# Altium schematic sheet Sheet1.SchDoc
size 750 x 500 mm; SheetNumber: 1; SheetTotal: 1
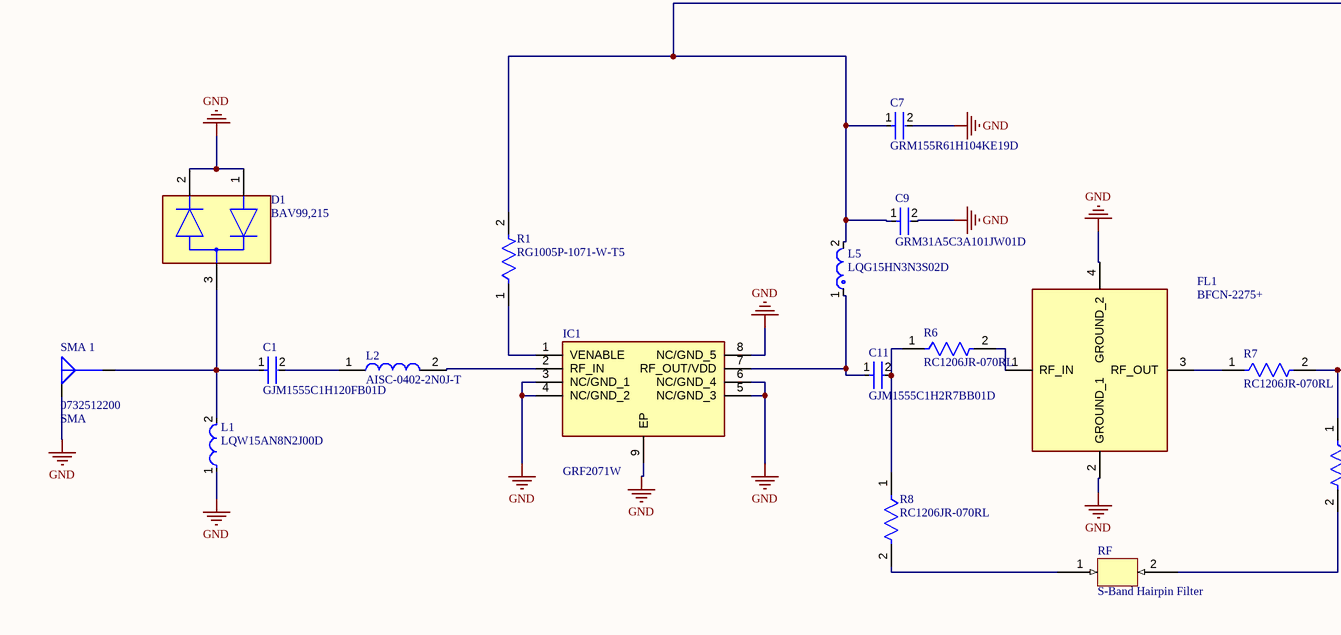
[diagram p0: Sheet1.SchDoc, left]
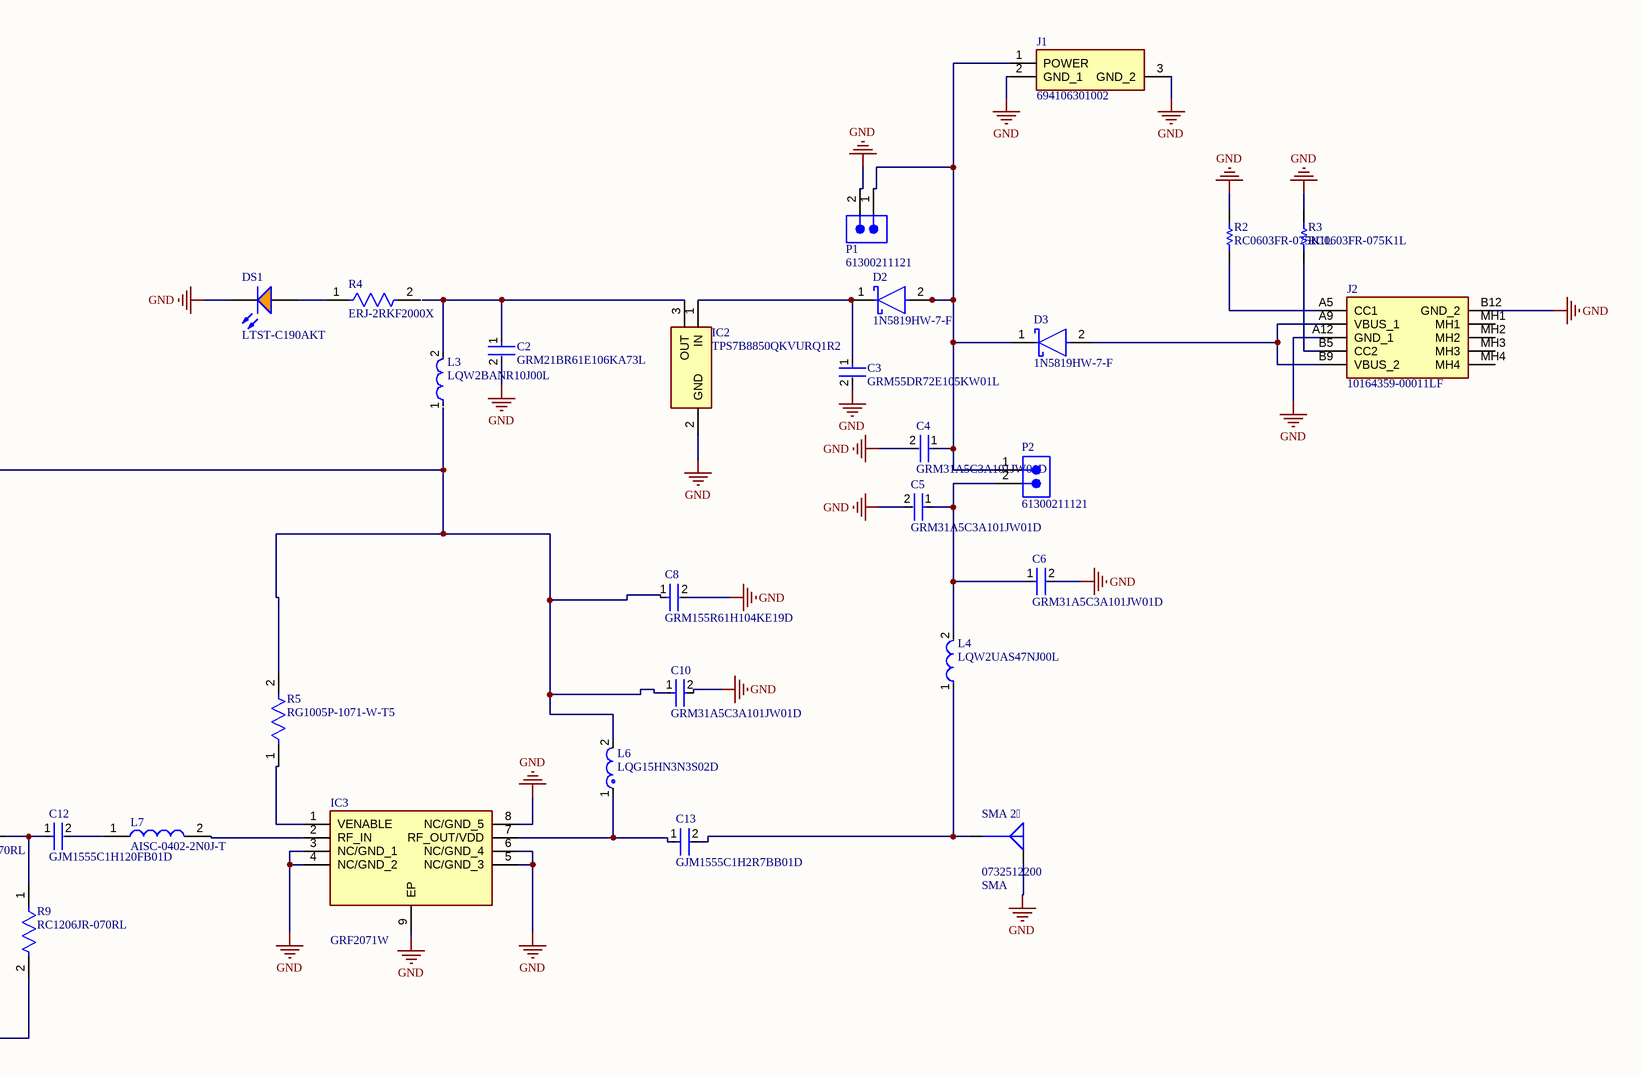
[diagram p1: Sheet1.SchDoc, right]

## Parts
C1  GJM1555C1H120FB01D  [FP-GJM155-0_05-IPC_A]
C2  GRM21BR61E106KA73L  [FP-GRM21B-0_15-IPC_C]
C3  GRM55DR72E105KW01L  [FP-GRM55D-0_4-IPC_A]
C4  GRM31A5C3A101JW01D  [FP-GRM31A-0_2-e0_3_0_95-IPC_B]
C5  GRM31A5C3A101JW01D  [FP-GRM31A-0_2-e0_3_0_95-IPC_B]
C6  GRM31A5C3A101JW01D  [FP-GRM31A-0_2-e0_3_0_95-IPC_B]
C7  GRM155R61H104KE19D  [FP-GRM155-0_05-IPC_A]
C8  GRM155R61H104KE19D  [FP-GRM155-0_05-IPC_A]
C9  GRM31A5C3A101JW01D  [FP-GRM31A-0_2-e0_3_0_95-IPC_B]
C10  GRM31A5C3A101JW01D  [FP-GRM31A-0_2-e0_3_0_95-IPC_B]
C11  GJM1555C1H2R7BB01D  [FP-GJM155-0_05-IPC_A]
C12  GJM1555C1H120FB01D  [FP-GJM155-0_05-IPC_A]
C13  GJM1555C1H2R7BB01D  [FP-GJM155-0_05-IPC_A]
D1  BAV99,215  [FP-SOT23-MFG]
D2  1N5819HW-7-F  [FP-SOD123-IPC_A]
D3  1N5819HW-7-F  [FP-SOD123-IPC_A]
DS1  LTST-C190AKT  [LTST-C190AKT-2_V]
FL1  BFCN-2275+  [BFCN2275]
IC1  GRF2071W  [SON50P200X200X75-9N]
IC2  TPS7B8850QKVURQ1R2  [TPS7B8850QKVURQ1R2]
IC3  GRF2071W  [SON50P200X200X75-9N]
J1  694106301002  [694106301002_1]
J2  10164359-00011LF  [1016435900011LF]
L1  LQW15AN8N2J00D  [FP-LQW15AN_00-W0_6-0_1-MFG]
L2  AISC-0402-2N0J-T  [AISC040210NGT]
L3  LQW2BANR10J00L  [FP-LQW2BAN_00-MFG]
L4  LQW2UAS47NJ00L  [FP-LQW2UAS_00-MFG]
L5  LQG15HN3N3S02D  [FP-LQG15HH_02-IPC_A]
L6  LQG15HN3N3S02D  [FP-LQG15HH_02-IPC_A]
L7  AISC-0402-2N0J-T  [AISC040210NGT]
P1  61300211121  [61300211121]
P2  61300211121  [61300211121]
R1  RG1005P-1071-W-T5  [FP-RG1005-IPC_C]
R2  RC0603FR-075K1L  [RESC1608X55X25ML10T15]
R3  RC0603FR-075K1L  [RESC1608X55X25ML10T15]
R4  ERJ-2RKF2000X  [FP-ERJ2RK-IPC_A]
R5  RG1005P-1071-W-T5  [FP-RG1005-IPC_C]
R6  RC1206JR-070RL  [FP-RC1206-MFG]
R7  RC1206JR-070RL  [FP-RC1206-MFG]
R8  RC1206JR-070RL  [FP-RC1206-MFG]
R9  RC1206JR-070RL  [FP-RC1206-MFG]
RF  S-Band Hairpin Filter  [S-BAND Hairpin Filter]
SMA_1  0732512200  Connector Style: SMA  [MOLEX SD-73251-220 (NICKEL, 2.79MM FEET)]
SMA_2  0732512200  Connector Style: SMA  [MOLEX SD-73251-220 (NICKEL, 2.79MM FEET)]

## Nets
GND: C2.2 C3.2 C4.2 C5.2 C6.2 C7.2 C8.2 C9.2 C10.2 D1.1 D1.2 DS1.2(K) FL1.2(GROUND_1) FL1.4(GROUND_2) IC1.3(NC/GND_1) IC1.4(NC/GND_2) IC1.5(NC/GND_3) IC1.6(NC/GND_4) IC1.8(NC/GND_5) IC1.9(EP) IC2.2(GND) IC3.3(NC/GND_1) IC3.4(NC/GND_2) IC3.5(NC/GND_3) IC3.6(NC/GND_4) IC3.8(NC/GND_5) IC3.9(EP) J1.2(GND_1) J1.3(GND_2) J2.A12(GND_1) J2.B12(GND_2) L1.1 P1.2 R2.2 R3.2 SMA_1.G SMA_2.G
NetC1_1: C1.1 D1.3 L1.2 SMA_1.S
NetC1_2: C1.2 L2.1
NetC2_1: C2.1 IC2.3(OUT) L3.2
NetC3_1: C3.1 D2.1(C) IC2.1(IN)
NetC4_1: C4.1 D2.2(A) D3.1(C) J1.1(POWER) P1.1 P2.1
NetC5_1: C5.1 C6.1 L4.2 P2.2
NetC7_1: C7.1 C8.1 C9.1 C10.1 L5.2 L6.2 R1.2 R5.2
NetC11_1: C11.1 IC1.7(RF_OUT/VDD) L5.1
NetC11_2: C11.2 R6.1 R8.1
NetC12_1: C12.1 R7.2 R9.1
NetC12_2: C12.2 L7.1
NetC13_1: C13.1 IC3.7(RF_OUT/VDD) L6.1
NetC13_2: C13.2 L4.1 SMA_2.S
NetD3_2: D3.2(A) J2.A9(VBUS_1) J2.B9(VBUS_2)
NetDS1_1: DS1.1(A) R4.1
NetFL1_1: FL1.1(RF_IN) R6.2
NetFL1_3: FL1.3(RF_OUT) R7.1
NetIC1_1: IC1.1(VENABLE) R1.1
NetIC1_2: IC1.2(RF_IN) L2.2
NetIC3_1: IC3.1(VENABLE) R5.1
NetIC3_2: IC3.2(RF_IN) L7.2
NetJ2_A5: J2.A5(CC1) R2.1
NetJ2_B5: J2.B5(CC2) R3.1
NetR8_2: R8.2 RF.1
NetR9_2: R9.2 RF.2

Not connected (* = marked no-connect by the designer): J2 MH1 MH2 MH3 MH4; L3 1; R4 2

## Notes on the sheet
- THIS DOCUMENT AND THE DATA DISCLOSED HEREIN OR
- HEREWITH IS THE PROPERTY OF ALTIUM LIMITED AND MAY
- DWG NO:
- REVISION
- REV:
- DESCRIPTION
- DATE
- APPROVED
- BE FREELY DISTRIBUTED IN WHOLE. NO RIGHTS ARE
- RESERVED OR EXPRESS OR IMPLIED WARANTEE GIVEN.
- ENG:
- APPROVALS
- PROJECT
- DSN:
- CHK:
- REFERENCE DOCUMENTS
- PROJECT REVISION:
- TITLE
- DOCUMENT REVISION:
- DESIGN ITEM:
- BOM:
- FAB DWG:
- PCB DWG:
- ASSY DWG:
- SCALE:
- A3
- SIZE
- CAGE CODE
- FILE NAME
- DWG NO.
- SHEET
- OF
- REV

## Library data of the parts
C1 C12 = CMP-06035-011502-1: Multi-Layer Ceramic Capacitor 12pF C0G  ±1% 0402 Paper T/R; Voltage Rating (DC): 50V; Dielectric: C0G; Case/Package: 0402; Termination: SMD/SMT; Case Code (Imperial): 0402; Case Code (Metric): 1005; Tolerance: 1%; Length: 1mm; Package Quantity: 10000; Voltage Rating: 50V; Depth: 0.5mm; Capacitance: 12pF; Packaging: Tape and Reel; Thickness: 0.022inch; Height: 0.5mm; Mount: Surface Mount; Radiation Hardening: No; Min Operating Temperature: -55°C; Max Operating Temperature: 125°C; Width: 0.02inch
C2 = CMP-2007-03541-2: Chip Multilayer Ceramic Capacitors for General Purpose, 0805, 10uF, X5R, 15%, 10%, 25V; Length: 2mm; Depth: 1.25mm; Termination: SMD/SMT; Voltage: 25V; Height: 1.25mm; Material: Ceramic; Thickness: 0.053inch; Radiation Hardening: No; Min Operating Temperature: -55°C; Width: 0.049inch; Package Quantity: 1; Mount: Surface Mount; Dielectric: X5R; Packaging: Tape and Reel; Capacitance: 10uF; Voltage Rating (DC): 25V; Lead Free: Lead Free; Max Operating Temperature: 85°C; Case Code (Imperial): 0805; Case/Package: 0805; Tolerance: 10%; Voltage Rating: 25V; Case Code (Metric): 2012
C3 = CMP-2000-06370-2: Chip Multilayer Ceramic Capacitors for General Purpose, 2220, 1.0uF, X7R, 15%, 10%, 250V; Capacitance: 1uF; Width: 5mm; Height: 2mm; Case Code (Imperial): 2220; Voltage Rating (DC): 250V; Max Operating Temperature: 125°C; Number of Pins: 2; Min Operating Temperature: -55°C; Termination: SMD/SMT; Case/Package: 2220; Dielectric: X7R; Material: Ceramic; REACH SVHC: No SVHC; Voltage: 250V; Packaging: Tape and Reel; Thickness: 0.087inch; Depth: 5mm; Package Quantity: 1; Tolerance: 10%; Mount: Surface Mount; Voltage Rating: 250V; Length: 5.7mm; Case Code (Metric): 5750; Lead Free: Lead Free
C4-C6 C9 C10 = CMP-06035-024306-1: Chip Multilayer Ceramic Capacitors for General Purpose, 1206, 100pF, C0G, 30ppm/°C, 5%, 1kV; Thickness: 0.039inch; Min Operating Temperature: -55°C; Voltage Rating: 1kV; Depth: 1.6mm; Temperature Coefficient: 30ppm/°C; Radiation Hardening: No; Case Code (Metric): 3216; Tolerance: 5%; Length: 3.2mm; Width: 0.063inch; Max Operating Temperature: 125°C; Voltage: 1kV; Capacitance: 100pF; Case Code (Imperial): 1206; Package Quantity: 4000; Dielectric: C0G; REACH SVHC: No SVHC; Voltage Rating (DC): 1kV; Case/Package: 1206; Mount: Surface Mount; Dielectric Material: Ceramic; Height: 1mm; Packaging: Tape and Reel; Termination: SMD/SMT
C7 C8 = CMP-2008-04108-2: Chip Multilayer Ceramic Capacitors for General Purpose, 0402, 0.10uF, X5R, 15%, 10%, 50V; Capacitance: 100nF; Case/Package: 0402; Voltage: 50V; Dielectric: X5R; Height: 0.5mm; Case Code (Metric): 1005; Length: 1mm; Width: 0.02inch; Mount: Surface Mount; Case Code (Imperial): 0402; Lead Free: Lead Free; Depth: 0.5mm; Max Operating Temperature: 85°C; Tolerance: 10%; Voltage Rating (DC): 50V; Packaging: Tape and Reel; REACH SVHC: No SVHC; Voltage Rating: 50V; Min Operating Temperature: -55°C; Thickness: 0.022inch
C11 C13 = CMP-2008-03840-2: Multi-Layer Ceramic Capacitor 2.7pF C0G  ±0.1pF 0402 Paper T/R; Voltage Rating (DC): 50V; Temperature Coefficient: 30ppm/°C; Max Operating Temperature: 125°C; Lead Free: Lead Free; REACH SVHC: No SVHC; Thickness: 0.022inch; Length: 1mm; Height: 0.5mm; Min Operating Temperature: -55°C; Mount: Surface Mount; Case/Package: 0402; Case Code (Imperial): 0402; Width: 0.02inch; Capacitance: 2.7pF; Packaging: Tape and Reel; Package Quantity: 10000; Lead Pitch: 0.3mm; Dielectric: C0G; Depth: 0.5mm; Voltage Rating: 50V; Radiation Hardening: No; Termination: SMD/SMT; Voltage: 50V; Number of Pins: 2; Case Code (Metric): 1005
D1 = CMP-14399-000006-1: DIODE ARRAY GP 100V 215MA SOT23
D2 D3 = CMP-0303-00003-3: DIODE SCHOTTKY 40V 1A SOD123; Forward Voltage: 450mV; Capacitance: 110pF; Max Forward Surge Current (Ifsm): 25A; Peak Reverse Current: 50uA; Polarity: Standard; Element Configuration: Single; Max Power Dissipation: 450mW; Min Operating Temperature: -65°C; Package Quantity: 3000; Contact Plating: Tin; Weight: 0.000353oz; Max Repetitive Reverse Voltage (Vrrm): 40V; Max Reverse Voltage (DC): 40V; Height: 1.25mm; Average Rectified Current: 1A; Width: 1.7mm; Case/Package: SOD-123-2; Lead Free: Lead Free; Max Operating Temperature: 125°C; Current Rating: 1A; Termination: SMD/SMT; Forward Current: 1A; Radiation Hardening: No; Number of Pins: 2; Length: 2.85mm; Voltage Rating (DC): 40V; REACH SVHC: No SVHC; Peak Non-Repetitive Surge Current: 25A; Packaging: Tape and Reel; Output Current: 1A
DS1 = CMP-007-00021-2: LED Uni-Color Orange, 100 mW, 30 mA, -55 to 85 degC, 2-Pin SMD, RoHS, Tape and Reel; Manufacturer: Lite-On; Lens Style: Clear; Forward Voltage: 2.1V; Luminous Intensity: 2mcd; Forward Current: 20mA; Viewing Angle: 130degrees; Package Reference: LTST-C190AKT-2; Case/Package: 0603; Min Operating Temperature: -55°C; Package Quantity: 3000; Illumination Colour: Orange; RoHS Compliant: True; Mounting Technology: SM; Manufacturer URL: http://www.us.liteon.com/; Datasheet URL: http://datasheet.octopart.com/LTST-C190AKT-Lite-On-datasheet-11729267.pdf; Pins: 2; Max Operating Temperature: 85°C; Packaging: TapeandReel; Colour: Orange; Nominal Vf: 2.1V; Datasheet Version: Jan-03; Package Description: 2-Pin Surface Mount Device, Body 1.6 x 0.8 mm
FL1 = BFCN-2275+: Filter; Manufacturer_Name: Mini-Circuits; Datasheet Link: https://www.minicircuits.com/pdfs/BFCN-2275+.pdf; Height: 0.94mm; Manufacturer_Part_Number: BFCN-2275+; Mouser Part Number: 139-BFCN-2275; Mouser Price/Stock: https://www.mouser.co.uk/ProductDetail/Mini-Circuits/BFCN-2275%2b?qs=xZ%2FP%252Ba9zWqbiN5sUHOguOg%3D%3D
IC1 IC3 = GRF2071W: Integrated Circuit; Manufacturer_Name: Guerrilla RF; Datasheet Link: https://www.mouser.com/datasheet/2/777/GRF2071_WDS-1891829.pdf; Height: 0.75mm; Manufacturer_Part_Number: GRF2071W; Mouser Part Number: 459-GRF2071W; Mouser Price/Stock: https://www.mouser.co.uk/ProductDetail/Guerrilla-RF/GRF2071W?qs=hWgE7mdIu5R0hLsGsKbNEA%3D%3D
IC2 = TPS7B8850QKVURQ1R2: Integrated Circuit; Manufacturer_Name: Texas Instruments; Datasheet Link: https://www.ti.com/lit/ds/symlink/tps7b88-q1.pdf?ts=1678685515389&ref_url=https%253A%252F%252Fwww.ti.com%252Fproduct%252FTPS7B88-Q1%252Fpart-details%252FTPS7B8850QKVURQ1R2; Height: 2.65mm; Manufacturer_Part_Number: TPS7B8850QKVURQ1R2; Mouser Part Number: 595-S7B8850QKVURQ1R2; Mouser Price/Stock: https://www.mouser.co.uk/ProductDetail/Texas-Instruments/TPS7B8850QKVURQ1R2?qs=e8oIoAS2J1TpaCt8B0rPIw%3D%3D; Arrow Part Number: TPS7B8850QKVURQ1R2; Arrow Price/Stock: https://www.arrow.com/en/products/tps7b8850qkvurq1r2/texas-instruments?region=nac
J1 = 694106301002: Connector; Manufacturer_Name: Wurth Elektronik; Datasheet Link: https://datasheet.datasheetarchive.com/originals/distributors/Datasheets_SAMA/1c153bd2ba42bb51bda59ee4cd9765cd.pdf; Manufacturer_Part_Number: 694106301002; Mouser Part Number: 710-694106301002; Mouser Price/Stock: https://www.mouser.co.uk/ProductDetail/Wurth-Elektronik/694106301002?qs=a9WhcLg8qCwOEkcI62k5mA%3D%3D
J2 = 10164359-00011LF: Connector; Manufacturer_Name: Amphenol; Datasheet Link: https://cdn.amphenol-cs.com/media/wysiwyg/files/drawing/10164359.pdf; Height: 3.41mm; Manufacturer_Part_Number: 10164359-00011LF; Mouser Part Number: 649-10164359-00011LF; Mouser Price/Stock: https://www.mouser.co.uk/ProductDetail/Amphenol-FCI/10164359-00011LF?qs=MyNHzdoqoQLpQ%2FmSqA1%252BtQ%3D%3D; Arrow Part Number: 10164359-00011LF; Arrow Price/Stock: https://www.arrow.com/en/products/10164359-00011lf/amphenol-fci?region=nac
L1 = CMP-06042-014403-1: Wire Wound RF Inductor 8.2nH ±5% 540mA 0.14Ω 0402 (1005); Core Material: Air; Q Factor: 25; Self Resonant Frequency: 5.5GHz; Shielding: Unshielded; Test Frequency: 100MHz; DC Resistance (DCR): 140mR; Case Code (Imperial): 0402; Case/Package: 0402; Tolerance: 5%; Case Code (Metric): 1005; Current Rating: 540mA; Width: 0.02inch; Length: 1mm; Height: 0.5mm; Military Standard: Not; Mount: Surface Mount; Min Operating Temperature: -55°C; Max Operating Temperature: 125°C; Termination: SMD/SMT; Inductance: 8.2nH; Weight: 2.8E-05oz; Max DC Current: 540mA; DC Current: 540mA; Depth: 0.7mm; Packaging: Tape and Reel; Lead Free: Lead Free; Radiation Hardening: No; Package Quantity: 1
L2 L7 = AISC-0402-2N0J-T: Inductor; Manufacturer_Name: ABRACON; Datasheet Link: https://abracon.com/Magnetics/new/AISC-0402.pdf; Height: 0.65mm; Manufacturer_Part_Number: AISC-0402-2N0J-T
L3 = CMP-06042-012426-1: Wire Wound RF Inductor 100nH ±5% 1050mA 0.35Ω 0805 (2015); Q Factor: 66; Test Frequency: 150MHz; Shielding: Unshielded; DC Resistance (DCR): 350mR; Max DC Current: 1.05A; Self Resonant Frequency: 1.2GHz; Inductance: 100nH; Height - Seated (Max): 0.06inch; Case/Package: Nonstandard; Length: 0.082inch; Termination: SMD/SMT; Packaging: Tape and Reel; Case Code (Imperial): 0805; Width: 0.06inch; Height: 1.42mm; Resistor Type: Wirewound; Max Operating Temperature: 125°C; Package Quantity: 2000; Current Rating: 1.05A; Min Operating Temperature: -55°C; Weight: 0.000494oz; Case Code (Metric): 2015; Tolerance: 5%; Mount: Surface Mount
L4 = CMP-06042-009410-1: Wire Wound RF Inductor 47nH ±5% 1000mA 0.16Ω 1008 (2520); Q Factor: 65; Current Rating: 1A; Shielding: Unshielded; Test Frequency: 50MHz; DC Resistance (DCR): 160mR; Core Material: Air; Self Resonant Frequency: 1.5GHz; Case Code (Imperial): 1008; Resistor Type: Wirewound; REACH SVHC: No SVHC; Inductance: 47nH; Packaging: Tape and Reel; Radiation Hardening: No; Case Code (Metric): 2520; Termination: SMD/SMT; Max Operating Temperature: 125°C; Package Quantity: 2000; Weight: 0.001376oz; Max DC Current: 1A; Case/Package: 1008; Width: 0.096inch; Length: 0.103inch; Depth: 2.65mm; Min Operating Temperature: -55°C; Mount: Surface Mount; Tolerance: 5%; Inductance Tolerance: 5%; Height: 1.83mm; Height - Seated (Max): 0.08inch
L5 L6 = CMP-06042-003843-1: Multilayer type RF Inductor 3.3nH ±0.3nH 0.12Ω 800mA 0402; DC Resistance (DCR): 190mR; Test Frequency: 100MHz; Core Material: Air; Current Rating: 300mA; Q Factor: 8; Self Resonant Frequency: 6GHz; Shielding: Unshielded; Termination: SMD/SMT; Case Code (Metric): 1005; Lead Free: Lead Free; Min Operating Temperature: -55°C; Radiation Hardening: No; Max Operating Temperature: 125°C; Mount: Surface Mount; Packaging: Tape and Reel; Length: 0.039inch; Case/Package: 0402; Depth: 0.55mm; Inductance: 3.3nH; REACH SVHC: No SVHC; Package Quantity: 10000; Current: 300mA; Height - Seated (Max): 0.022inch; Width: 0.02inch; DC Current: 300mA; Military Standard: Not; Max DC Current: 300mA; Case Code (Imperial): 0402; Height: 0.5mm
P1 P2 = CMP-1712-00002-5: NexarPartId: 20081794; Operating Supply Voltage: 250V; Current Rating: 3A; Gender: Male; Number of Contacts: 2; Pitch: 2.54mm; Connector Type: Male Pin; Contact Resistance: 20mΩ; Contact Plating: Gold; Contact Material: Copper; Number of Pins: 2; Min Operating Temperature: -40°C; Packaging: Bulk; Lead Pitch: 2.54mm; Mount: Through Hole; Orientation: Vertical; RoHS: Compliant; REACH SVHC: No SVHC; Height: 8.94mm; Termination: Through Hole; Number of Positions: 2; Contact Mating Length: 5.9944mm; Color: Black; Contact Gender: Male; Number of Rows: 1; Housing Material: PBT; Lead Free: Lead Free; Voltage Rating: 250V; Max Operating Temperature: 125°C
R1 R5 = CMP-28537-004894-1: Automotive Metal Thin Film Chip Resistor, 0402, 1.07kΩ, 0.05%, 25ppm/°C, 0.0625W, 75V; Power Rating: 30mW; Voltage Rating (DC): 25V; Max Power Dissipation: 63mW; Resistance: 1.07kR; Min Operating Temperature: -55°C; Max Operating Temperature: 155°C; Temperature Coefficient: 25ppm/°C; RoHS Compliant: Yes; Number of Terminations: 2; Case Code (Metric): 1005; Case Code (Imperial): 0402; Lead Free: Lead Free; Series: RG; Packaging: Tape and Reel; Resistor Type: Thin Film; Height: 0.016inch; Features: Automotive AEC-Q200; Width: 0.5mm; Case/Package: 0402; Tolerance: 0.05%; Package Quantity: 5000; Termination: SMD/SMT; Length: 0.039inch; Voltage Rating: 25V
R2 R3 = CMP-2000-04091-1: Manufacturer: Yageo; Part Number: RC0603FR-075K1L
R4 = CMP-2002-00757-2: RES SMD 200 OHM 1% 1/10W 0402; Power Rating: 100mW; Voltage Rating (DC): 50V; Resistance: 200R; Temperature Coefficient: 100ppm/°C; RoHS Compliant: Yes; Packaging: Tape and Reel; Case Code (Metric): 1005; Package Quantity: 1; Contact Plating: Tin; Series: ERJ; Mount: Surface Mount; Lead Free: Lead Free; Min Operating Temperature: -55°C; Number of Terminations: 2; Max Power Dissipation: 100mW; Technology: THICK FILM; Voltage Rating: 50V; Case/Package: 0402; Width: 0.02inch; Termination: SMD/SMT; Military Standard: Not; Height: 0.35mm; Radiation Hardening: No; Resistance Tolerance: 1%; Length: 1mm; REACH SVHC: No SVHC; Construction: Rectangular; Depth: 0.5mm; Features: Automotive AEC-Q200; Resistor Type: Thick Film; Case Code (Imperial): 0402; Tolerance: 1%; Size Code: 0402; Max Operating Temperature: 155°C
R6-R9 = CMP-2100-03681-2: RES SMD 0 OHM JUMPER 1/4W 1206; Manufacturer: YAGEO; Voltage Rating: 200V; Temperature Coefficient: 300ppm/°C; Power Rating: 0.25W; Value: 0Ω; Tolerance: 5%; Manufacturer Part Number: RC1206JR-070RL; Temperature Range Low: -55°C; Category: Res; Automotive: No; Ipc Land Pattern Name: RESC310160X55; Device Class L1: Passive Components; Temperature: -55°C to +155°C; ComponentLink2URL: https://www.yageo.com/upload/media/product/productsearch/datasheet/rchip/PYu-RC_Group_51_RoHS_L_10.pdf; Lead Free: Yes; Height: 0.65mm; Footprint Url: https://www.yageo.com/upload/website/yageo_PYu-R_Mount_10_19050818_343.pdf; Package: RC1206; Digikey Description: RES SMD 0 OHM JUMPER 1/4W 1206; Temperature Range High: +155°C; Device Class L3: Chip SMD Resistors; Device Class L2: Resistors; Octopart: https://octopart.com/rc1206jr-070rl-yageo-40025601; Resistance: 0Ω; Series: RC; ComponentLink2Description: Datasheet; Composition: Thick Film; RoHS: TRUE; Mouser Description: Resistor: thick film; SMD; 1206; 0O; 0.25W; ±5%; -55÷155°C
RF = S-band-2: :D
SMA_1 SMA_2 = 0732512200: CONN SMA JACK R/A 50 OHM PCB; Manufacturer: Molex; Connector Type: Jack, Female Socket; Contact Termination: Solder; Frequency - Max: 18GHz; Impedance: 50Ohm; Number of Ports: 1; Part Number: 0732512200; ComponentLink1Description: Datasheet; ComponentLink1URL: https://www.molex.com/pdm_docs/ps/PS-89675-346.pdf; ComponentLink2Description: DigiKey Link; ComponentLink2URL: http://digikey.com/product-detail/en/molex/0732512200/WM9352-ND/3468838; Fastening Type: Threaded; Housing Color: Silver; LastUpdated: 6/29/2022 6:13:17 PM; Lifecycle Status: Active; Minimum Order: 1; Mounting Feature: Bulkhead - Front Side Nut; Mounting Type: Panel Mount, Through Hole, Right Angle; Packaging: Bulk; Part Status: Active; Price: 5.75; Series: 73251; Shield Termination: Solder; Supplier 1: DigiKey; Supplier Part Number 1: WM9352-ND